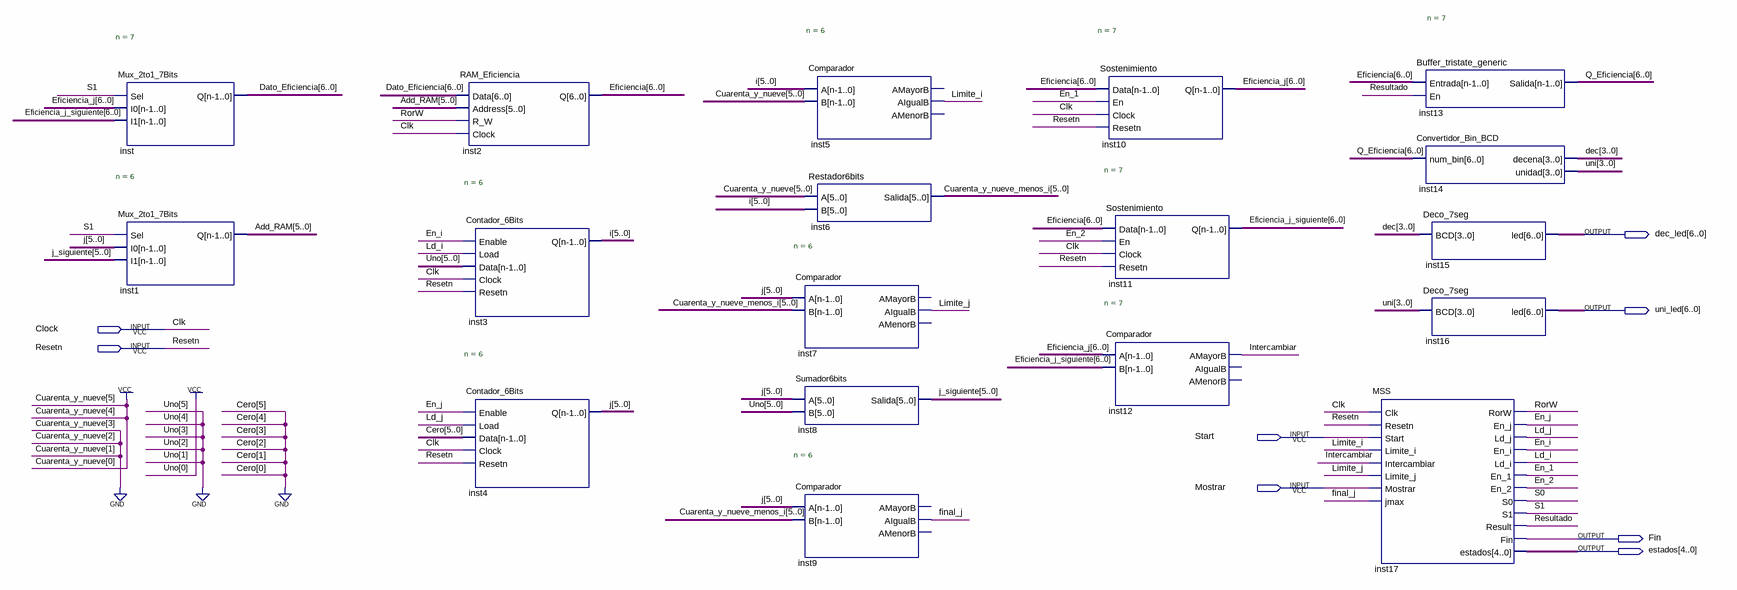
[diagram p0: schematic sheet]
// Quartus schematic Diagrama.bdf as structural Verilog: 18 symbols, 8 pins
module Diagrama (
  input  Clock,
  input  Resetn,
  input  Start,
  input  Mostrar,
  output [6:0] dec_led,
  output [6:0] uni_led,
  output Fin,
  output [4:0] estados
);

  wire En_1, En_2, En_i, En_j, final_j, Intercambiar, Ld_i, Ld_j, Limite_i, Limite_j, Resultado, RorW, S0, S1;
  wire [3:0] dec, uni;
  wire [5:0] Add_RAM, Cuarenta_y_nueve_menos_i, i, j, j_siguiente;
  wire [6:0] Dato_Eficiencia, Eficiencia, Eficiencia_j, Eficiencia_j_siguiente, Q_Eficiencia;

  Mux_2to1_7Bits #(.n(7)) inst (.Sel(S1), .I0(Eficiencia_j), .I1(Eficiencia_j_siguiente), .Q(Dato_Eficiencia));
  Mux_2to1_7Bits #(.n(6)) inst1 (.Sel(S1), .I0(j), .I1(j_siguiente), .Q(Add_RAM));
  RAM_Eficiencia inst2 (.Data(Dato_Eficiencia), .Address(Add_RAM), .R_W(RorW), .Clock(Clock), .Q(Eficiencia));
  Contador_6Bits #(.n(6)) inst3 (.Enable(En_i), .Load(Ld_i), .Data(6'b000001), .Clock(Clock), .Resetn(Resetn), .Q(i));
  Contador_6Bits #(.n(6)) inst4 (.Enable(En_j), .Load(Ld_j), .Data({6{1'b0}}), .Clock(Clock), .Resetn(Resetn), .Q(j));
  Comparador #(.n(6)) inst5 (.A(i), .B(6'b110001), .AIgualB(Limite_i));  // open: AMayorB, AMenorB
  Restador6bits inst6 (.A(6'b110001), .B(i), .Salida(Cuarenta_y_nueve_menos_i));
  Comparador #(.n(6)) inst7 (.A(j), .B(Cuarenta_y_nueve_menos_i), .AIgualB(Limite_j));  // open: AMayorB, AMenorB
  Sumador6bits inst8 (.A(j), .B(6'b000001), .Salida(j_siguiente));
  Comparador #(.n(6)) inst9 (.A(j), .B(Cuarenta_y_nueve_menos_i), .AIgualB(final_j));  // open: AMayorB, AMenorB
  Sostenimiento #(.n(7)) inst10 (.Data(Eficiencia), .En(En_1), .Clock(Clock), .Resetn(Resetn), .Q(Eficiencia_j));
  Sostenimiento #(.n(7)) inst11 (
    .Data(Eficiencia), .En(En_2), .Clock(Clock), .Resetn(Resetn), .Q(Eficiencia_j_siguiente));
  Comparador #(.n(7)) inst12 (
    .A(Eficiencia_j), .B(Eficiencia_j_siguiente), .AMayorB(Intercambiar));  // open: AIgualB, AMenorB
  MSS inst17 (
    .Clk(Clock), .Resetn(Resetn), .Start(Start), .Limite_i(Limite_i), .Intercambiar(Intercambiar),
    .Limite_j(Limite_j), .Mostrar(Mostrar), .jmax(final_j), .RorW(RorW), .En_j(En_j), .Ld_j(Ld_j),
    .En_i(En_i), .Ld_i(Ld_i), .En_1(En_1), .En_2(En_2), .S0(S0), .S1(S1), .Result(Resultado), .Fin(Fin),
    .estados(estados));
  Buffer_tristate_generic #(.n(7)) inst13 (.Entrada(Eficiencia), .En(Resultado), .Salida(Q_Eficiencia));
  Convertidor_Bin_BCD inst14 (.num_bin(Q_Eficiencia), .decena(dec), .unidad(uni));
  Deco_7seg inst15 (.BCD(dec), .led(dec_led));
  Deco_7seg inst16 (.BCD(uni), .led(uni_led));

  // Other names for the same wires on the sheet: Clk = Clock
endmodule
